# Altium schematic sheet TOP_SCHEMATIC.SchDoc
size A3; SheetNumber: 1; SheetTotal: 8
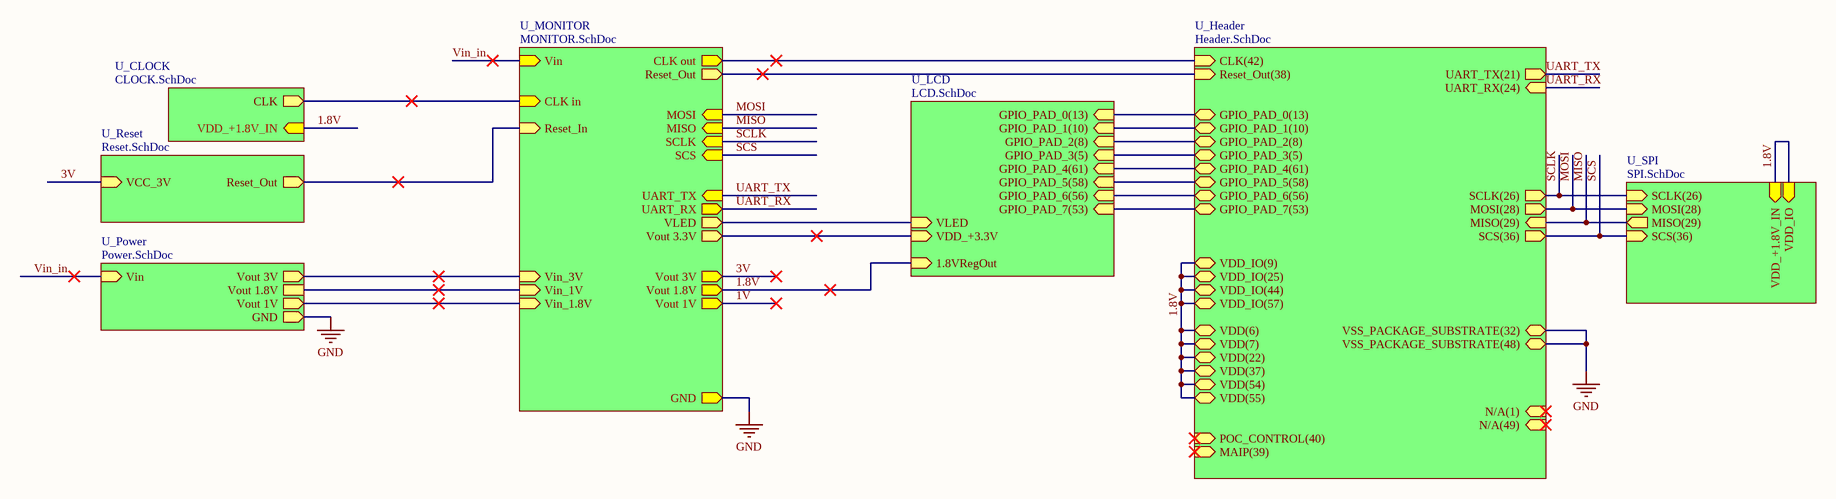
[diagram p0: TOP_SCHEMATIC.SchDoc]

## Sub-sheets
U_CLOCK = CLOCK.SchDoc: VDD_+1.8V_IN (in), CLK (out)
U_Header = Header.SchDoc: UART_TX(21) (out), UART_RX(24) (in), VDD(6) (bidir), CLK(42) (in), VDD_IO(44) (bidir), VDD_IO(25) (bidir), VDD_IO(9) (bidir), VDD(7) (bidir), VDD(22) (bidir), Reset_Out(38) (in), VDD(55) (bidir), VDD(54) (bidir), VDD(37) (bidir), SCLK(26) (out), MOSI(28) (out), MISO(29) (in), SCS(36) (out), VSS_PACKAGE_SUBSTRATE(32) (bidir), VSS_PACKAGE_SUBSTRATE(48) (bidir), N/A(1) (in), N/A(49) (in), POC_CONTROL(40) (in), MAIP(39) (in), GPIO_PAD_0(13) (bidir), GPIO_PAD_1(10) (bidir), GPIO_PAD_2(8) (bidir), GPIO_PAD_3(5) (bidir), GPIO_PAD_4(61) (bidir), GPIO_PAD_5(58) (bidir), GPIO_PAD_6(56) (bidir), GPIO_PAD_7(53) (bidir), VDD_IO(57) (bidir)
U_LCD = LCD.SchDoc: GPIO_PAD_0(13) (in), GPIO_PAD_7(53) (in), GPIO_PAD_6(56) (in), GPIO_PAD_5(58) (in), GPIO_PAD_4(61) (in), GPIO_PAD_1(10) (in), GPIO_PAD_2(8) (in), GPIO_PAD_3(5) (in), 1.8VRegOut (in), VDD_+3.3V, VLED (in)
U_MONITOR = MONITOR.SchDoc: Vin (in), CLK in (in), Reset_In (in), GND (out), CLK out (out), Reset_Out (out), MISO (in), SCLK (in), SCS (in), UART_TX (in), UART_RX (out), Vout 3V (out), Vout 1.8V (out), Vout 1V (out), Vin_3V (in), Vin_1V (in), Vin_1.8V (in), Vout 3.3V (out), MOSI (in), VLED (out)
U_Power = Power.SchDoc: Vin (in), Vout 3V (out), Vout 1.8V, GND (out), Vout 1V (out)
U_Reset = Reset.SchDoc: VCC_3V (in), Reset_Out (out)
U_SPI = SPI.SchDoc: MOSI(28) (in), SCLK(26) (in), MISO(29) (out), SCS(36) (in), VDD_IO (in), VDD_+1.8V_IN (in)

## Nets
GND: sheet U_Header/VSS_PACKAGE_SUBSTRATE(32), sheet U_Header/VSS_PACKAGE_SUBSTRATE(48), sheet U_MONITOR/GND, sheet U_Power/GND
1.8V: sheet U_Header/VDD(6), sheet U_Header/VDD_IO(44), sheet U_Header/VDD_IO(25), sheet U_Header/VDD_IO(9), sheet U_Header/VDD(7), sheet U_Header/VDD(22), sheet U_Header/VDD(55), sheet U_Header/VDD(54), sheet U_Header/VDD(37), sheet U_Header/VDD_IO(57), sheet U_CLOCK/VDD_+1.8V_IN, sheet U_SPI/VDD_IO, sheet U_SPI/VDD_+1.8V_IN, sheet U_MONITOR/Vout 1.8V, sheet U_LCD/1.8VRegOut
1V: sheet U_MONITOR/Vout 1V
3V: sheet U_MONITOR/Vout 3V, sheet U_Reset/VCC_3V
MISO: sheet U_Header/MISO(29), sheet U_SPI/MISO(29), sheet U_MONITOR/MISO
MOSI: sheet U_Header/MOSI(28), sheet U_SPI/MOSI(28), sheet U_MONITOR/MOSI
SCLK: sheet U_Header/SCLK(26), sheet U_SPI/SCLK(26), sheet U_MONITOR/SCLK
SCS: sheet U_Header/SCS(36), sheet U_SPI/SCS(36), sheet U_MONITOR/SCS
UART_RX: sheet U_Header/UART_RX(24), sheet U_MONITOR/UART_RX
UART_TX: sheet U_Header/UART_TX(21), sheet U_MONITOR/UART_TX
Vin_in: sheet U_MONITOR/Vin, sheet U_Power/Vin
(unnamed): sheet U_Header/CLK(42), sheet U_MONITOR/CLK out
(unnamed): sheet U_Header/Reset_Out(38), sheet U_MONITOR/Reset_Out
(unnamed): sheet U_Header/GPIO_PAD_0(13), sheet U_LCD/GPIO_PAD_0(13)
(unnamed): sheet U_Header/GPIO_PAD_1(10), sheet U_LCD/GPIO_PAD_1(10)
(unnamed): sheet U_Header/GPIO_PAD_2(8), sheet U_LCD/GPIO_PAD_2(8)
(unnamed): sheet U_Header/GPIO_PAD_3(5), sheet U_LCD/GPIO_PAD_3(5)
(unnamed): sheet U_Header/GPIO_PAD_4(61), sheet U_LCD/GPIO_PAD_4(61)
(unnamed): sheet U_Header/GPIO_PAD_5(58), sheet U_LCD/GPIO_PAD_5(58)
(unnamed): sheet U_Header/GPIO_PAD_6(56), sheet U_LCD/GPIO_PAD_6(56)
(unnamed): sheet U_Header/GPIO_PAD_7(53), sheet U_LCD/GPIO_PAD_7(53)
(unnamed): sheet U_CLOCK/CLK, sheet U_MONITOR/CLK in
(unnamed): sheet U_MONITOR/Reset_In, sheet U_Reset/Reset_Out
(unnamed): sheet U_MONITOR/Vin_3V, sheet U_Power/Vout 3V
(unnamed): sheet U_MONITOR/Vin_1V, sheet U_Power/Vout 1.8V
(unnamed): sheet U_MONITOR/Vin_1.8V, sheet U_Power/Vout 1V
(unnamed): sheet U_MONITOR/Vout 3.3V, sheet U_LCD/VDD_+3.3V
(unnamed): sheet U_MONITOR/VLED, sheet U_LCD/VLED